# EAGLE design S107X (EAGLE 6.6.0)
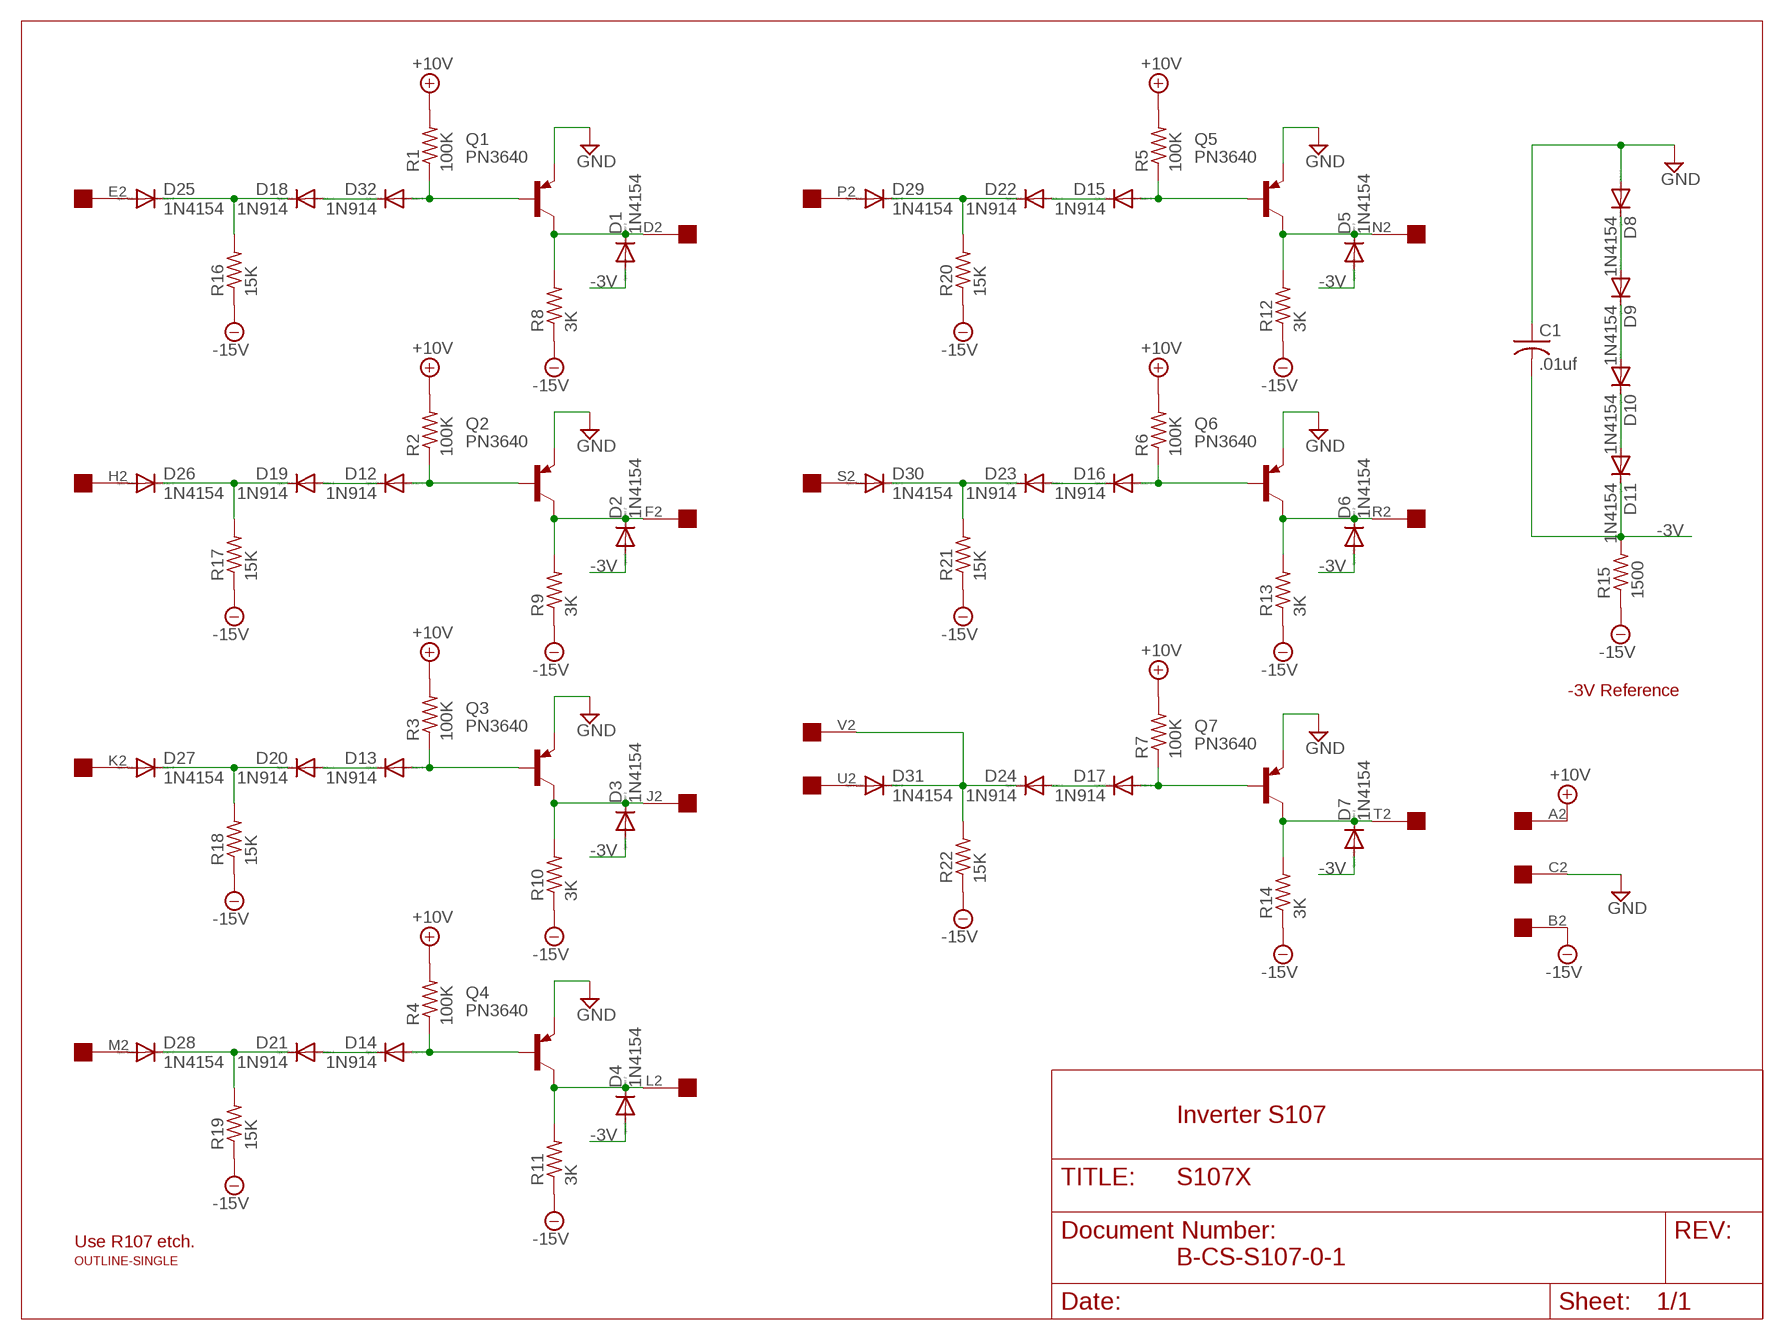
[diagram p0: schematic, sheet 1]

## Parts
C1  .01uf  C-US050-025X075  [C050-025X075]
D1  1N4154  1N4148DO35-10  [DO35-10]
D2  1N4154  1N4148DO35-10  [DO35-10]
D3  1N4154  1N4148DO35-10  [DO35-10]
D4  1N4154  1N4148DO35-10  [DO35-10]
D5  1N4154  1N4148DO35-10  [DO35-10]
D6  1N4154  1N4148DO35-10  [DO35-10]
D7  1N4154  1N4148DO35-10  [DO35-10]
D8  1N4154  1N4148DO35-10  [DO35-10]
D9  1N4154  1N4148DO35-10  [DO35-10]
D10  1N4154  1N4148DO35-10  [DO35-10]
D11  1N4154  1N4148DO35-10  [DO35-10]
D12  1N914  1N4148DO35-10  [DO35-10]
D13  1N914  1N4148DO35-10  [DO35-10]
D14  1N914  1N4148DO35-10  [DO35-10]
D15  1N914  1N4148DO35-10  [DO35-10]
D16  1N914  1N4148DO35-10  [DO35-10]
D17  1N914  1N4148DO35-10  [DO35-10]
D18  1N914  1N4148DO35-10  [DO35-10]
D19  1N914  1N4148DO35-10  [DO35-10]
D20  1N914  1N4148DO35-10  [DO35-10]
D21  1N914  1N4148DO35-10  [DO35-10]
D22  1N914  1N4148DO35-10  [DO35-10]
D23  1N914  1N4148DO35-10  [DO35-10]
D24  1N914  1N4148DO35-10  [DO35-10]
D25  1N4154  1N4148DO35-10  [DO35-10]
D26  1N4154  1N4148DO35-10  [DO35-10]
D27  1N4154  1N4148DO35-10  [DO35-10]
D28  1N4154  1N4148DO35-10  [DO35-10]
D29  1N4154  1N4148DO35-10  [DO35-10]
D30  1N4154  1N4148DO35-10  [DO35-10]
D31  1N4154  1N4148DO35-10  [DO35-10]
D32  1N914  1N4148DO35-10  [DO35-10]
Q1  PN3640  2N3637  [TO39]
Q2  PN3640  2N3637  [TO39]
Q3  PN3640  2N3637  [TO39]
Q4  PN3640  2N3637  [TO39]
Q5  PN3640  2N3637  [TO39]
Q6  PN3640  2N3637  [TO39]
Q7  PN3640  2N3637  [TO39]
R1  100K  R-US_0207/10  [0207/10]
R2  100K  R-US_0207/10  [0207/10]
R3  100K  R-US_0207/10  [0207/10]
R4  100K  R-US_0207/10  [0207/10]
R5  100K  R-US_0207/10  [0207/10]
R6  100K  R-US_0207/10  [0207/10]
R7  100K  R-US_0207/10  [0207/10]
R8  3K  R-US_0207/10  [0207/10]
R9  3K  R-US_0207/10  [0207/10]
R10  3K  R-US_0207/10  [0207/10]
R11  3K  R-US_0207/10  [0207/10]
R12  3K  R-US_0207/10  [0207/10]
R13  3K  R-US_0207/10  [0207/10]
R14  3K  R-US_0207/10  [0207/10]
R15  1500  R-US_0207/10  [0207/10]
R16  15K  R-US_0207/10  [0207/10]
R17  15K  R-US_0207/10  [0207/10]
R18  15K  R-US_0207/10  [0207/10]
R19  15K  R-US_0207/10  [0207/10]
R20  15K  R-US_0207/10  [0207/10]
R21  15K  R-US_0207/10  [0207/10]
R22  15K  R-US_0207/10  [0207/10]
U$1  OUTLINE-SINGLE  [SINGLE]
U$2  EDGE-1  [EDGE-CON1]

## Nets
+10V [Power]: R1.2 R2.2 R3.2 R4.2 R5.2 R6.2 R7.2 U$2.A2
-3V [Power]: C1.2 D1.A D2.A D3.A D4.A D5.A D6.A D7.A D11.C R15.2
-15V [Power]: R8.1 R9.1 R10.1 R11.1 R12.1 R13.1 R14.1 R15.1 R16.1 R17.1 R18.1 R19.1 R20.1 R21.1 R22.1 U$2.B2
GND [Power]: C1.1 D8.A Q1.1(E) Q2.1(E) Q3.1(E) Q4.1(E) Q5.1(E) Q6.1(E) Q7.1(E) U$2.C2
N$1: D7.C Q7.3(C) R14.2 U$2.T2
N$2: D12.A Q2.2(B) R2.1
N$3: D8.C D9.A
N$4: D2.C Q2.3(C) R9.2 U$2.F2
N$5: D26.A U$2.H2
N$6: D19.C D26.C R17.2
N$7: D12.C D19.A
N$8: D13.A Q3.2(B) R3.1
N$9: D3.C Q3.3(C) R10.2 U$2.J2
N$10: D27.A U$2.K2
N$11: D20.C D27.C R18.2
N$12: D13.C D20.A
N$13: D9.C D10.A
N$14: D31.A U$2.U2
N$15: D17.A Q7.2(B) R7.1
N$16: D10.C D11.A
N$17: D24.C D31.C R22.2 U$2.V2
N$18: D17.C D24.A
N$19: D32.A Q1.2(B) R1.1
N$20: D1.C Q1.3(C) R8.2 U$2.D2
N$21: D25.A U$2.E2
N$22: D18.C D25.C R16.2
N$23: D18.A D32.C
N$24: D14.A Q4.2(B) R4.1
N$25: D4.C Q4.3(C) R11.2 U$2.L2
N$26: D28.A U$2.M2
N$27: D21.C D28.C R19.2
N$28: D14.C D21.A
N$29: D15.A Q5.2(B) R5.1
N$30: D5.C Q5.3(C) R12.2 U$2.N2
N$31: D29.A U$2.P2
N$32: D22.C D29.C R20.2
N$33: D15.C D22.A
N$34: D16.A Q6.2(B) R6.1
N$35: D6.C Q6.3(C) R13.2 U$2.R2
N$36: D30.A U$2.S2
N$37: D23.C D30.C R21.2
N$38: D16.C D23.A

## Notes on the sheet
- -3V Reference
- Inverter S107
- Use R107 etch.
- B-CS-S107-0-1

## Library data of the parts
C1 = rcl:C-US: CAPACITOR, American symbol
D1-D32 = diode:1N4148: DIODE high speed (Philips)
Q1-Q7 = transistor-pnp:2N3637*: PNP Transistror
R1-R22 = rcl:R-US_: RESISTOR, American symbol
U$1 = dec-con:OUTLINE-*: Board outlines for DEC boards.
U$2 = dec-con:EDGE-1: Single-Sided DEC Edge Connector -- (side 2)

## Net classes
1 Power: width 0.813 mm

## Board
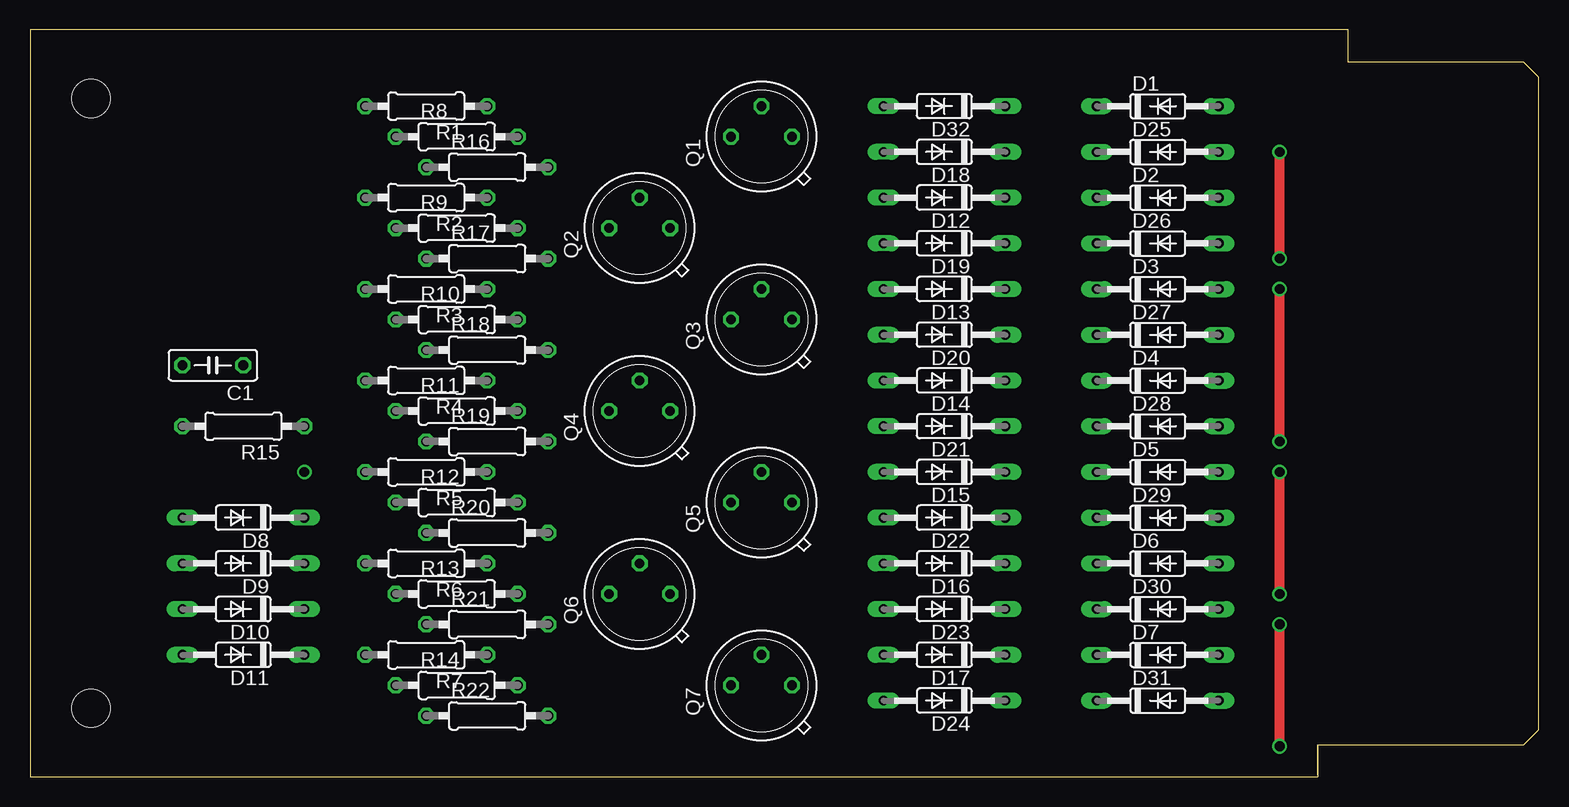
[diagram p1: board, top side]
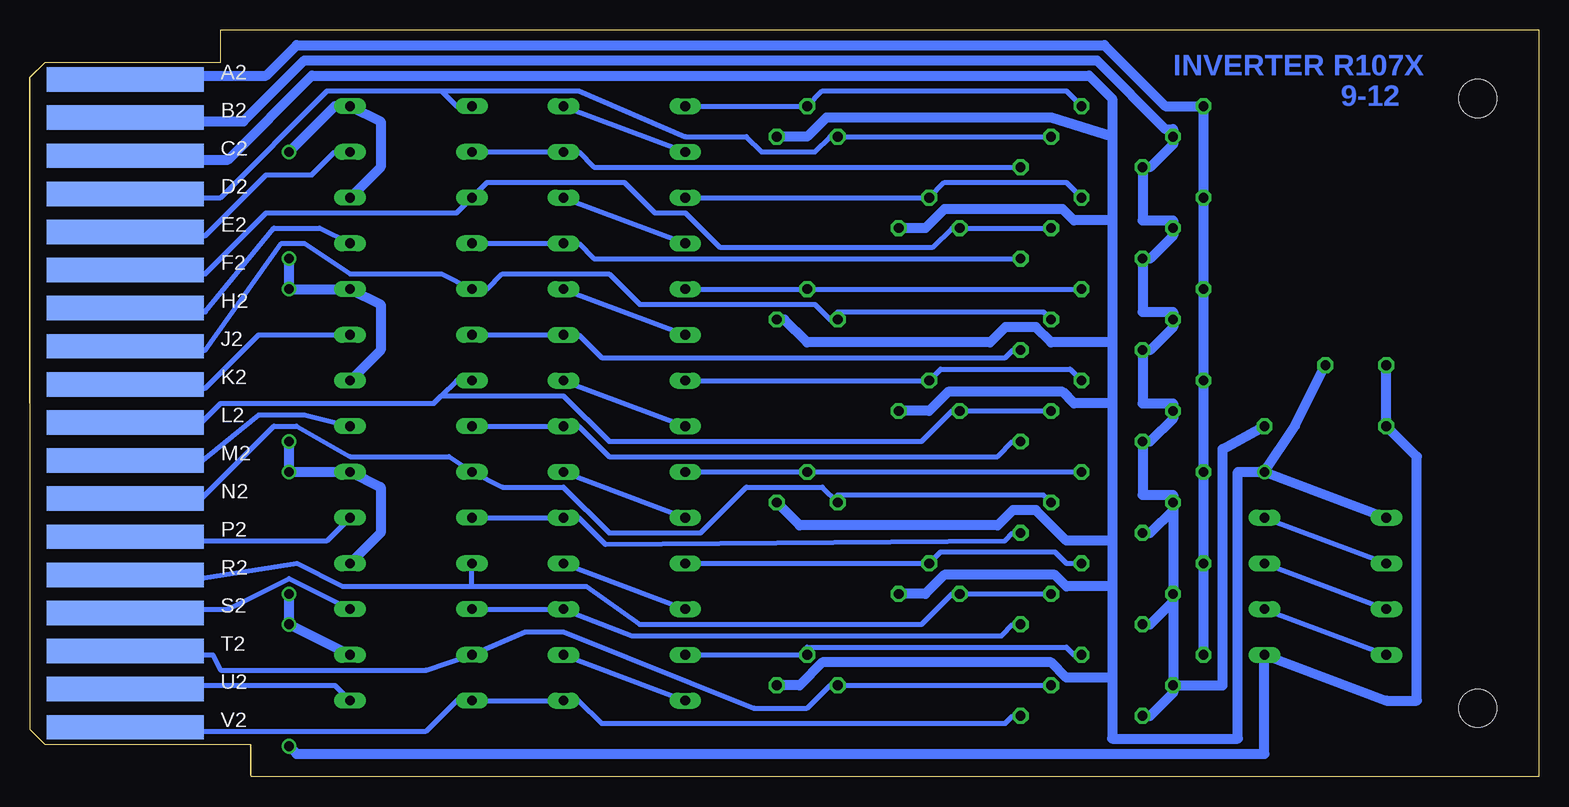
[diagram p2: board, bottom side, seen from below]

Size 125.73 x 62.23 mm. Coordinates in mm from the lower left corner, seen from the top.
Copper layers (1+16): Top 0.035mm / dielectric 1.5mm / Bottom 0.035mm
Design rules "16mils": minimum track width 16mil, minimum drill 32mil, track to track 15mil, track to pad 10mil, pad to pad 10mil, via to via 10mil, smd to smd 10mil, copper to edge 13mil, drill to drill 10mil, minimum pad ring 10mil, minimum via ring 8mil, stop-mask expansion 0mil, vias tented up to drill 0mil, thermal gap 10mil

### Footprints (pad centres in the part's own frame; a part is rotated, then mirrored left to right if it is on the bottom)
C050-025X075 = drill 0.813 octagon: 1 -2.54,0; 2 2.54,0
DO35-10 = drill 0.813 long: A 5.08,0; C -5.08,0
TO39 = drill 0.813 octagon: 1 0,-2.54; 2 2.54,0; 3 0,2.54
0207/10 = drill 0.813 octagon: 1 -5.08,0; 2 5.08,0
SINGLE = hole 3.175: 120.65,56.515; 120.65,5.715
EDGE-CON1 = smd 13.106 x 2.032 bottom: A2 7.938,4.128; B2 7.938,7.303; C2 7.938,10.477; D2 7.938,13.652; E2 7.938,16.828; F2 7.938,20.003; H2 7.938,23.177; J2 7.938,26.352; K2 7.938,29.527; L2 7.938,32.703; M2 7.938,35.877; N2 7.938,39.053; P2 7.938,42.227; R2 7.938,45.403; S2 7.938,48.578; T2 7.938,51.752; U2 7.938,54.928; V2 7.938,58.102

### Placement (x,y rotation side)
C1  15.24,34.29 180 top
D1  93.98,55.88 0 top
D2  93.98,48.26 0 top
D3  93.98,40.64 0 top
D4  93.98,33.02 0 top
D5  93.98,25.4 0 top
D6  93.98,17.78 0 top
D7  93.98,10.16 0 top
D8  17.78,21.59 180 top
D9  17.78,17.78 180 top
D10  17.78,13.97 180 top
D11  17.78,10.16 180 top
D12  76.2,48.26 180 top
D13  76.2,40.64 180 top
D14  76.2,33.02 180 top
D15  76.2,25.4 180 top
D16  76.2,17.78 180 top
D17  76.2,10.16 180 top
D18  76.2,52.07 180 top
D19  76.2,44.45 180 top
D20  76.2,36.83 180 top
D21  76.2,29.21 180 top
D22  76.2,21.59 180 top
D23  76.2,13.97 180 top
D24  76.2,6.35 180 top
D25  93.98,52.07 0 top
D26  93.98,44.45 0 top
D27  93.98,36.83 0 top
D28  93.98,29.21 0 top
D29  93.98,21.59 0 top
D30  93.98,13.97 0 top
D31  93.98,6.35 0 top
D32  76.2,55.88 180 top
Q1  60.96,53.34 90 top
Q2  50.8,45.72 90 top
Q3  60.96,38.1 90 top
Q4  50.8,30.48 90 top
Q5  60.96,22.86 90 top
Q6  50.8,15.24 90 top
Q7  60.96,7.62 90 top
R1  33.02,55.88 180 top
R2  33.02,48.26 180 top
R3  33.02,40.64 180 top
R4  33.02,33.02 180 top
R5  33.02,25.4 180 top
R6  33.02,17.78 180 top
R7  33.02,10.16 180 top
R8  35.56,53.34 0 top
R9  35.56,45.72 0 top
R10  35.56,38.1 0 top
R11  35.56,30.48 0 top
R12  35.56,22.86 0 top
R13  35.56,15.24 0 top
R14  35.56,7.62 0 top
R15  17.78,29.21 180 top
R16  38.1,50.8 0 top
R17  38.1,43.18 0 top
R18  38.1,35.56 0 top
R19  38.1,27.94 0 top
R20  38.1,20.32 0 top
R21  38.1,12.7 0 top
R22  38.1,5.08 0 top
U$1  125.73,62.23 180 top
U$2  125.73,62.23 180 top

### Tracks (layer width: path | path; a pad name or v marks a point on that pad's centre or on a via)
+10V
  Bottom 0.813: R7.2 R6.2 R5.2 R4.2 R3.2 R2.2 R1.2 31.11,55.88 36.2,60.96 103.5,60.96 106.05,58.42 111.76,58.42 U$2.A2
-3V  (via drill 0.81)
  Top 0.813: v104.14,2.54 v104.14,12.7 | v104.14,15.24 v104.14,25.4 | v104.14,27.94 v104.14,40.64 | v104.14,43.18 v104.14,52.07
  Bottom 0.813: v104.14,15.24 v104.14,12.7 D7.A | v104.14,27.94 v104.14,25.4 D5.A 96.52,24.13 96.52,20.32 D6.A | v104.14,43.18 v104.14,40.64 D3.A 96.52,39.37 96.52,35.56 D4.A | v104.14,52.07 100.33,55.88 D1.A 96.52,54.61 96.52,50.8 D2.A | v104.14,2.54 103.5,1.91 22.86,1.91 D11.C 12.7,6.35 10.16,6.35 10.16,26.67 R15.2 C1.2
-15V
  Bottom 0.813: R22.1 32.38,5.08 30.48,6.99 R14.1 | 30.48,14.61 32.38,12.7 R21.1 | 30.48,14.61 R14.1 | 30.48,14.61 R13.1 30.48,22.23 | 30.48,22.23 32.38,20.32 R20.1 | 30.48,22.23 R12.1 30.48,23.5 33.02,23.5 R19.1 32.38,27.94 30.48,29.84 R11.1 30.48,31.11 33.02,31.11 R18.1 32.38,35.56 30.48,37.47 R10.1 30.48,38.73 33.02,38.73 R17.1 32.38,43.18 30.48,45.09 R9.1 30.48,46.35 33.02,46.35 R16.1 32.38,50.8 30.48,52.7 R8.1 30.48,53.98 31.11,53.98 36.83,59.69 102.87,59.69 107.95,54.61 113.03,54.61 U$2.B2 | R15.1 26.35,27.3 26.35,7.62 R14.1
GND  (via drill 0.81)
  Bottom 0.813: Q6.1 51.12,15.24 49.53,16.83 40.32,16.83 39.37,15.88 35.56,15.88 | 35.56,15.88 35.56,8.26 | 35.56,8.26 39.37,8.26 40.64,9.53 59.69,9.53 61.59,7.62 Q7.1 | Q5.1 61.59,20.95 45.09,20.95 43.81,22.23 41.91,22.23 39.37,19.68 35.56,19.68 | 35.56,19.68 35.56,15.88 | 35.56,36.2 35.56,31.11 | 35.56,31.11 35.56,19.68 | Q2.1 51.12,45.72 49.53,47.31 39.69,47.31 38.73,46.35 35.56,46.35 | 35.56,36.2 40.64,36.2 41.91,37.47 44.45,37.47 45.72,36.2 60.96,36.2 62.87,38.1 Q3.1 | 35.56,53.34 35.56,56.52 37.47,58.42 102.23,58.42 109.22,51.44 113.03,51.44 U$2.C2 | 35.56,53.34 35.56,46.35 | v22.86,25.4 D8.A | v22.86,25.4 20.32,29.21 C1.1 | v22.86,25.4 25.08,25.4 25.08,3.17 35.56,3.17 35.56,8.26 | 35.56,46.35 35.56,36.2 | Q4.1 50.8,30.48 49.21,32.07 39.69,32.07 38.73,31.11 35.56,31.11 | Q1.1 60.96,53.34 59.37,54.93 40.64,54.93 35.56,53.34
N$1
  Bottom 0.406: R14.2 Q7.3 59.05,7.62 60.96,5.71 65.41,5.71 81.28,12.06 84.45,12.06 D7.C 92.71,8.89 109.86,8.89 110.49,10.16 111.76,10.16 U$2.T2
N$2
  Bottom 0.406: D12.A Q2.2 49.53,49.53 39.37,49.53 R2.1
N$3
  Bottom 0.406: D8.C D9.A
N$4
  Bottom 0.406: R9.2 Q2.3 48.9,45.72 50.48,44.13 68.26,44.13 71.12,46.99 73.66,46.99 76.2,49.53 87.63,49.53 D2.C 90.17,46.99 106.05,46.99 111.12,41.91 111.76,41.91 U$2.F2
N$5
  Bottom 0.406: D26.A 101.6,45.72 105.41,45.72 111.12,38.73 111.76,38.73 U$2.H2
N$6
  Bottom 0.406: R17.2 78.74,43.18 80.01,44.45 D19.C D26.C
N$7
  Bottom 0.406: D12.C D19.A
N$8
  Bottom 0.406: R3.1 Q3.2 D13.A
N$9
  Bottom 0.406: R10.2 41.27,38.73 58.42,38.73 Q3.3 59.05,38.1 60.33,39.37 74.93,39.37 77.47,41.91 86.36,41.91 87.63,40.64 D3.C 91.44,41.91 99.06,41.91 102.87,44.45 104.78,44.45 111.12,35.56 111.76,35.56 U$2.J2
N$10
  Bottom 0.406: D27.A 106.68,36.83 111.12,32.38 111.76,32.38 U$2.K2
N$11
  Bottom 0.406: D27.C D20.C 80.01,36.83 78.11,34.92 44.45,34.92 43.81,35.56 R18.2
N$12
  Bottom 0.406: D13.C D20.A
N$13
  Bottom 0.406: D9.C D10.A
N$14
  Bottom 0.406: D31.A 100.33,7.62 111.76,7.62 U$2.U2
N$15
  Bottom 0.406: R7.1 38.73,10.16 39.37,10.79 60.96,10.79 Q7.2 D17.A
N$16
  Bottom 0.406: D10.C D11.A
N$17
  Bottom 0.406: R22.2 43.81,5.08 44.45,4.45 78.11,4.45 80.01,6.35 D24.C D31.C 90.17,6.35 92.71,3.81 112.39,3.81 113.03,4.45 U$2.V2
N$18
  Bottom 0.406: D17.C D24.A
N$19
  Bottom 0.406: R1.1 39.37,57.15 59.69,57.15 Q1.2 D32.A
N$20
  Bottom 0.406: R8.2 Q1.3 59.05,53.34 60.33,52.07 64.77,52.07 66.04,53.34 71.12,53.34 80.01,57.15 91.44,57.15 | 91.44,57.15 90.17,55.88 D1.C | 91.44,57.15 100.97,57.15 109.86,48.26 113.03,48.26 U$2.D2
N$21
  Bottom 0.406: D25.A 100.33,52.07 102.23,50.16 106.05,50.16 111.12,45.09 113.03,45.09 U$2.E2
N$22
  Bottom 0.406: R16.2 78.74,50.8 80.01,52.07 D18.C D25.C
N$23
  Bottom 0.406: D32.C D18.A
N$24
  Bottom 0.406: R4.1 39.05,33.97 49.85,33.97 Q4.2 D14.A
N$25
  Bottom 0.406: R11.2 Q4.3 48.9,30.48 51.44,27.94 77.47,27.94 81.28,31.75 91.44,31.75 | 91.44,31.75 92.08,31.11 109.86,31.11 111.76,29.21 U$2.L2 | 91.44,31.75 90.17,33.02 D4.C
N$26
  Bottom 0.406: D28.A 102.87,30.16 106.68,30.16 111.76,26.04 U$2.M2
N$27
  Bottom 0.406: R19.2 43.81,27.94 45.09,26.67 77.47,26.67 80.01,29.21 D21.C D28.C
N$28
  Bottom 0.406: D14.C D21.A
N$29
  Bottom 0.406: R5.1 Q5.2 D15.A
N$30
  Bottom 0.406: R12.2 41.27,23.5 58.42,23.5 Q5.3 59.69,24.13 66.04,24.13 69.85,20.32 77.47,20.32 81.28,24.13 86.36,24.13 D5.C 90.81,26.67 99.06,26.67 103.5,29.21 105.41,29.21 111.76,22.86 U$2.N2
N$31
  Bottom 0.406: D29.A 100.97,19.68 111.76,19.68 U$2.P2
N$32
  Bottom 0.406: R20.2 43.81,20.32 44.45,19.68 77.79,19.37 80.01,21.59 D22.C D29.C
N$33
  Bottom 0.406: D15.C D22.A
N$34
  Bottom 0.406: R6.1 39.37,17.78 40.32,18.73 49.85,18.73 Q6.2 D16.A
N$35
  Bottom 0.406: R13.2 Q6.3 48.9,15.24 51.44,12.7 74.93,12.7 79.38,15.88 88.9,15.88 | 88.9,15.88 99.69,15.88 103.5,17.78 111.76,16.51 U$2.R2 | 88.9,15.88 D6.C
N$36
  Bottom 0.406: D30.A 104.14,16.51 109.22,13.97 111.76,13.97 U$2.S2
N$37
  Bottom 0.406: R21.2 43.81,12.7 44.77,11.75 75.56,11.75 D23.C D30.C
N$38
  Bottom 0.406: D16.C D23.A

### Text on the board
Bottom: INVERTER R107X | 9-12